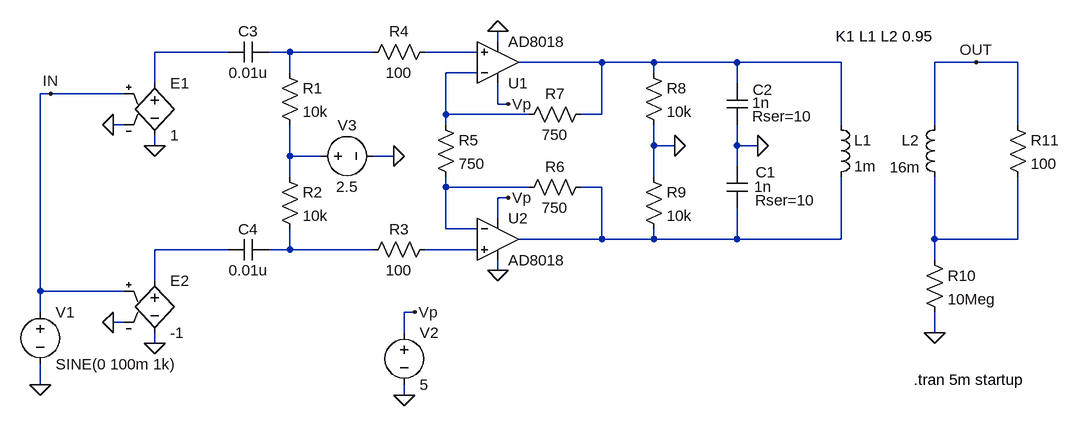
[diagram p0: schematic AD8018.asc]
AD8018.asc, the LTspice schematic file:
Version 4.1
SHEET 1 1204 680
WIRE 192 32 192 16
WIRE -224 48 -336 48
WIRE -128 48 -160 48
WIRE 0 48 -128 48
WIRE 160 48 80 48
WIRE 352 64 224 64
WIRE 432 64 352 64
WIRE 560 64 432 64
WIRE 720 64 560 64
WIRE 928 64 864 64
WIRE 992 64 928 64
WIRE -128 80 -128 48
WIRE 160 80 112 80
WIRE 432 80 432 64
WIRE -336 96 -336 48
WIRE 560 96 560 64
WIRE -496 112 -512 112
WIRE -384 112 -496 112
WIRE 192 128 192 96
WIRE 208 128 192 128
WIRE 112 144 112 80
WIRE 240 144 112 144
WIRE 352 144 352 64
WIRE 352 144 320 144
WIRE -384 160 -400 160
WIRE 112 160 112 144
WIRE 720 160 720 64
WIRE 864 160 864 64
WIRE 992 160 992 64
WIRE -336 192 -336 176
WIRE 432 192 432 160
WIRE 464 192 432 192
WIRE 560 192 560 160
WIRE 592 192 560 192
WIRE -128 208 -128 160
WIRE -80 208 -128 208
WIRE 32 208 0 208
WIRE 560 224 560 192
WIRE -128 240 -128 208
WIRE 432 240 432 192
WIRE 112 256 112 240
WIRE 240 256 112 256
WIRE 352 256 320 256
WIRE 208 272 192 272
WIRE 192 304 192 272
WIRE 112 320 112 256
WIRE 160 320 112 320
WIRE 352 336 352 256
WIRE 352 336 224 336
WIRE 432 336 432 320
WIRE 432 336 352 336
WIRE 560 336 560 288
WIRE 560 336 432 336
WIRE 720 336 720 240
WIRE 720 336 560 336
WIRE 864 336 864 240
WIRE 992 336 992 240
WIRE 992 336 864 336
WIRE -224 352 -336 352
WIRE -128 352 -128 320
WIRE -128 352 -160 352
WIRE 0 352 -128 352
WIRE 160 352 80 352
WIRE 864 368 864 336
WIRE 192 384 192 368
WIRE -336 400 -336 352
WIRE -512 416 -512 112
WIRE -384 416 -512 416
WIRE -512 448 -512 416
WIRE 64 448 48 448
WIRE -384 464 -400 464
WIRE 48 480 48 448
WIRE 864 480 864 448
WIRE -336 496 -336 480
WIRE -512 560 -512 528
WIRE 48 576 48 560
FLAG 464 192 0
FLAG 592 192 0
FLAG 32 208 0
FLAG -336 192 0
FLAG -336 496 0
FLAG -400 464 0
FLAG -400 160 0
FLAG -512 560 0
FLAG 192 384 0
FLAG 208 272 Vp
FLAG 208 128 Vp
FLAG 48 576 0
FLAG 64 448 Vp
FLAG 192 16 0
FLAG 864 480 0
FLAG 928 64 OUT
FLAG -496 112 IN
SYMBOL AD8018 192 128 M180
SYMATTR InstName U1
SYMBOL AD8018 192 272 R0
SYMATTR InstName U2
SYMBOL res 96 144 R0
SYMATTR InstName R5
SYMATTR Value 750
SYMBOL res 336 128 R90
WINDOW 0 0 56 VBottom 2
WINDOW 3 32 56 VTop 2
SYMATTR InstName R7
SYMATTR Value 750
SYMBOL res 336 240 R90
WINDOW 0 0 56 VBottom 2
WINDOW 3 32 56 VTop 2
SYMATTR InstName R6
SYMATTR Value 750
SYMBOL res 416 64 R0
SYMATTR InstName R8
SYMATTR Value 10k
SYMBOL res 416 224 R0
SYMATTR InstName R9
SYMATTR Value 10k
SYMBOL cap 544 96 R0
WINDOW 0 40 10 Left 2
WINDOW 3 39 30 Left 2
WINDOW 123 39 51 Left 2
SYMATTR InstName C2
SYMATTR Value 1n
SYMATTR Value2 Rser=10
SYMATTR SpiceLine ic=2.5
SYMBOL cap 544 224 R0
WINDOW 0 45 9 Left 2
WINDOW 3 42 31 Left 2
WINDOW 123 44 52 Left 2
SYMATTR InstName C1
SYMATTR Value 1n
SYMATTR Value2 Rser=10
SYMATTR SpiceLine ic=2.5
SYMBOL res 96 32 R90
WINDOW 0 0 56 VBottom 2
WINDOW 3 32 56 VTop 2
SYMATTR InstName R4
SYMATTR Value 100
SYMBOL res 96 336 R90
WINDOW 0 0 56 VBottom 2
WINDOW 3 32 56 VTop 2
SYMATTR InstName R3
SYMATTR Value 100
SYMBOL res -144 64 R0
SYMATTR InstName R1
SYMATTR Value 10k
SYMBOL res -144 224 R0
SYMATTR InstName R2
SYMATTR Value 10k
SYMBOL voltage -96 208 R270
WINDOW 0 32 56 VTop 2
WINDOW 3 -32 56 VBottom 2
SYMATTR InstName V3
SYMATTR Value 2.5
SYMBOL cap -160 32 R90
WINDOW 0 0 32 VBottom 2
WINDOW 3 32 32 VTop 2
SYMATTR InstName C3
SYMATTR Value 0.01u
SYMBOL cap -160 336 R90
WINDOW 0 0 32 VBottom 2
WINDOW 3 32 32 VTop 2
SYMATTR InstName C4
SYMATTR Value 0.01u
SYMBOL e -336 80 R0
SYMATTR InstName E1
SYMATTR Value 1
SYMBOL e -336 384 R0
SYMATTR InstName E2
SYMATTR Value -1
SYMBOL voltage -512 432 R0
WINDOW 123 0 0 Left 0
WINDOW 39 0 0 Left 0
SYMATTR InstName V1
SYMATTR Value SINE(0 100m 1k)
SYMBOL voltage 48 464 R0
SYMATTR InstName V2
SYMATTR Value 5
SYMBOL ind 704 144 R0
SYMATTR InstName L1
SYMATTR Value 1m
SYMATTR SpiceLine Rser=0.5 Rpar=10Meg
SYMBOL ind 880 256 R180
WINDOW 0 40 72 Left 2
WINDOW 3 38 31 Left 2
SYMATTR InstName L2
SYMATTR Value 16m
SYMATTR SpiceLine Rser=160 Rpar=10Meg
SYMBOL res 976 144 R0
SYMATTR InstName R11
SYMATTR Value 100
SYMBOL res 848 352 R0
SYMATTR InstName R10
SYMATTR Value 10Meg
TEXT 832 552 Left 2 !.tran 5m startup
TEXT 712 24 Left 2 !K1 L1 L2 0.95

The netlist it stands for:
* AD8018.asc
* U1: AD8018 (symbol AD8018 not available, pins judged from their places): In+=N003 In-=N005 V+=Vp V-=0 OUT=N004
* U2: AD8018 (symbol AD8018 not available, pins judged from their places): In+=N012 In-=N007 V+=Vp V-=0 OUT=N008
R5 N005 N007 750
R7 N004 N005 750
R6 N008 N007 750
R8 N004 0 10k
R9 0 N008 10k
C2 N004 0 1n Rser=10 ic=2.5
C1 0 N008 1n Rser=10 ic=2.5
R4 N003 N002 100
R3 N012 N011 100
R1 N002 N006 10k
R2 N006 N011 10k
V3 N006 0 2.5
C3 N002 N001 0.01u
C4 N011 N010 0.01u
E1 N001 0 IN 0 1
E2 N010 0 IN 0 -1
V1 IN 0 SINE(0 100m 1k)
V2 Vp 0 5
L1 N004 N008 1m Rser=0.5 Rpar=10Meg
L2 N009 OUT 16m Rser=160 Rpar=10Meg
R11 OUT N009 100
R10 N009 0 10Meg
.tran 5m startup
K1 L1 L2 0.95
.backanno
.end